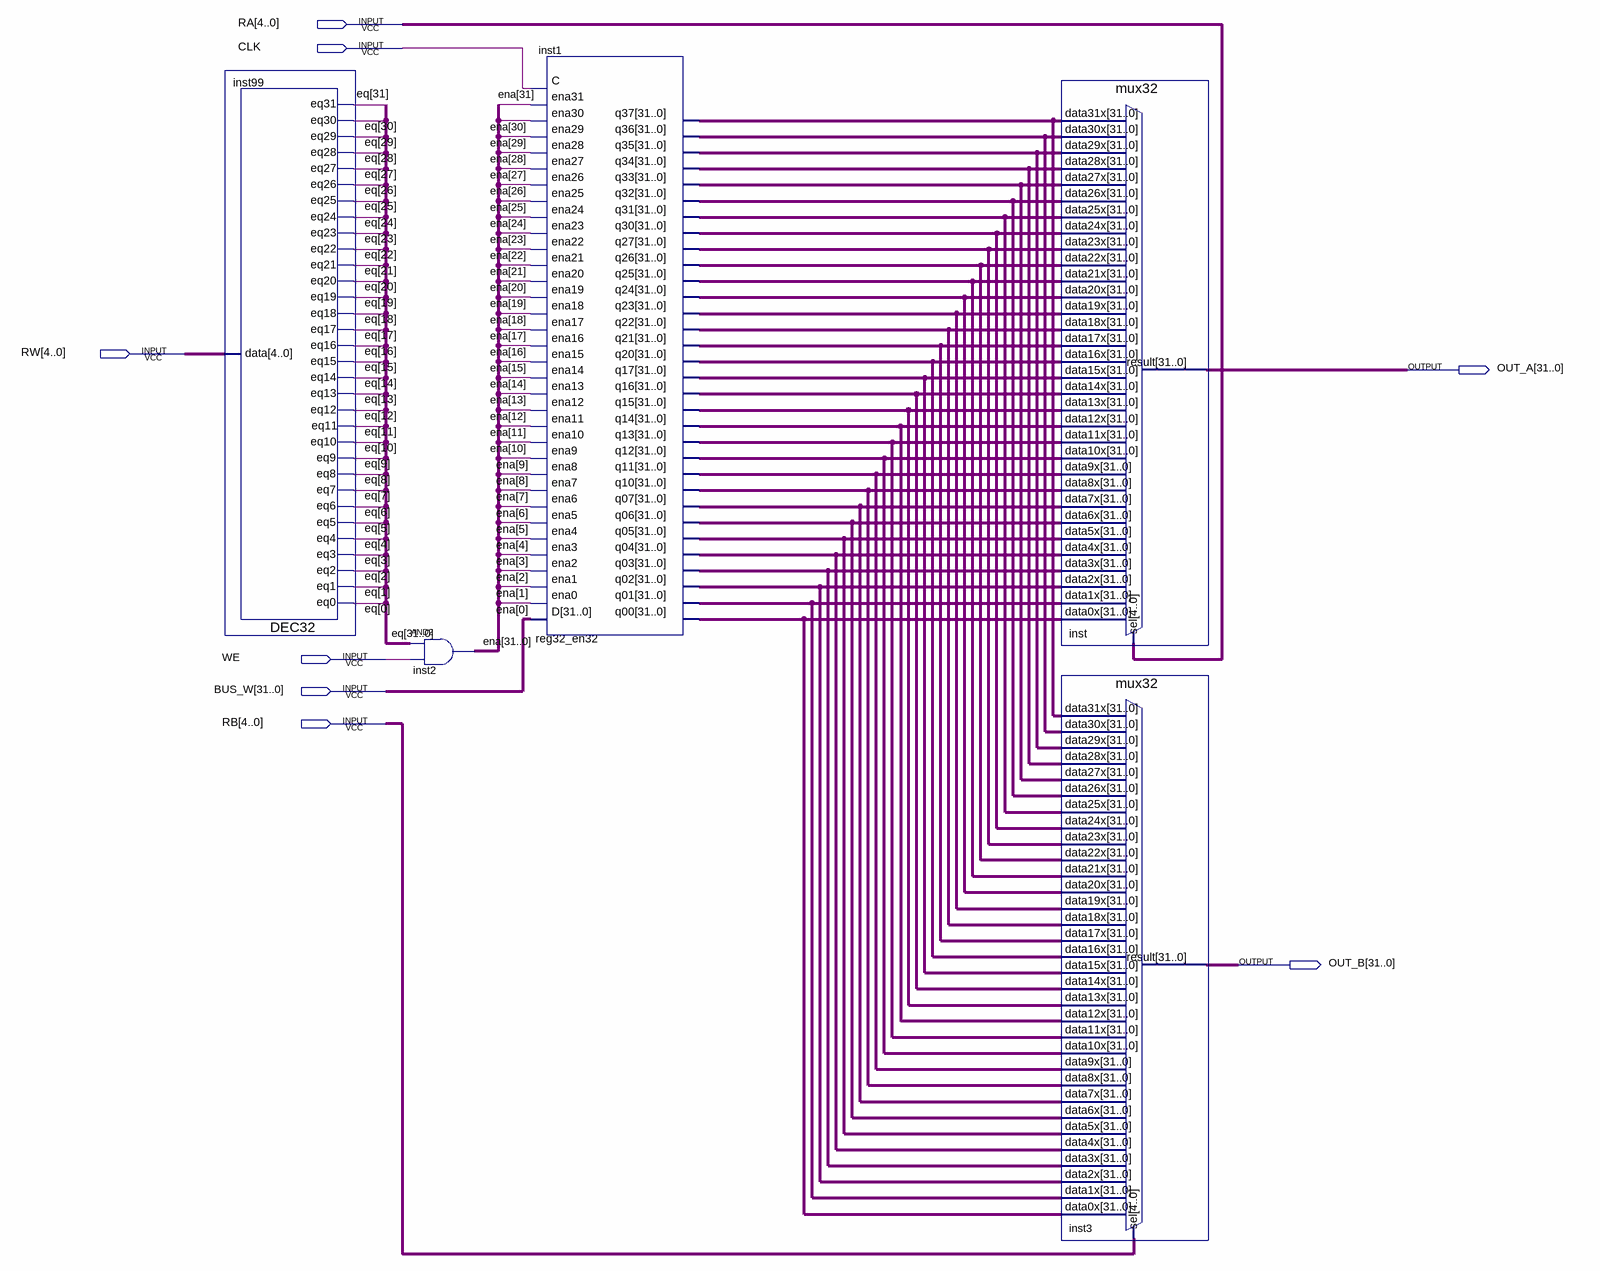
[diagram p0: schematic sheet]
// Quartus schematic Lab3_2.bdf as structural Verilog: 5 symbols, 8 pins
module Lab3_2 (
  input  [4:0] RA,
  input  CLK,
  input  [4:0] RW,
  input  WE,
  input  [31:0] BUS_W,
  input  [4:0] RB,
  output [31:0] OUT_A,
  output [31:0] OUT_B
);

  wire [31:0] ena, eq, inst1_q00, inst1_q01, inst1_q02, inst1_q03, inst1_q04, inst1_q05, inst1_q06,
       inst1_q07, inst1_q10, inst1_q11, inst1_q12, inst1_q13, inst1_q14, inst1_q15, inst1_q16, inst1_q17,
       inst1_q20, inst1_q21, inst1_q22, inst1_q23, inst1_q24, inst1_q25, inst1_q26, inst1_q27, inst1_q30,
       inst1_q31, inst1_q32, inst1_q33, inst1_q34, inst1_q35, inst1_q36, inst1_q37;

  DEC32 inst99 (
    .data(RW), .eq0(eq[0]), .eq1(eq[1]), .eq2(eq[2]), .eq3(eq[3]), .eq4(eq[4]), .eq5(eq[5]), .eq6(eq[6]),
    .eq7(eq[7]), .eq8(eq[8]), .eq9(eq[9]), .eq10(eq[10]), .eq11(eq[11]), .eq12(eq[12]), .eq13(eq[13]),
    .eq14(eq[14]), .eq15(eq[15]), .eq16(eq[16]), .eq17(eq[17]), .eq18(eq[18]), .eq19(eq[19]), .eq20(eq[20]),
    .eq21(eq[21]), .eq22(eq[22]), .eq23(eq[23]), .eq24(eq[24]), .eq25(eq[25]), .eq26(eq[26]), .eq27(eq[27]),
    .eq28(eq[28]), .eq29(eq[29]), .eq30(eq[30]), .eq31(eq[31]));
  assign ena = eq & {32{WE}};  // AND2 inst2, 32 bits wide
  reg32_en32 inst1 (
    .D(BUS_W), .ena0(ena[0]), .ena1(ena[1]), .ena2(ena[2]), .ena3(ena[3]), .ena4(ena[4]), .ena5(ena[5]),
    .ena6(ena[6]), .ena7(ena[7]), .ena8(ena[8]), .ena9(ena[9]), .ena10(ena[10]), .ena11(ena[11]),
    .ena12(ena[12]), .ena13(ena[13]), .ena14(ena[14]), .ena15(ena[15]), .ena16(ena[16]), .ena17(ena[17]),
    .ena18(ena[18]), .ena19(ena[19]), .ena20(ena[20]), .ena21(ena[21]), .ena22(ena[22]), .ena23(ena[23]),
    .ena24(ena[24]), .ena25(ena[25]), .ena26(ena[26]), .ena27(ena[27]), .ena28(ena[28]), .ena29(ena[29]),
    .ena30(ena[30]), .ena31(ena[31]), .C(CLK), .q00(inst1_q00), .q01(inst1_q01), .q02(inst1_q02),
    .q03(inst1_q03), .q04(inst1_q04), .q05(inst1_q05), .q06(inst1_q06), .q07(inst1_q07), .q10(inst1_q10),
    .q11(inst1_q11), .q12(inst1_q12), .q13(inst1_q13), .q14(inst1_q14), .q15(inst1_q15), .q16(inst1_q16),
    .q17(inst1_q17), .q20(inst1_q20), .q21(inst1_q21), .q22(inst1_q22), .q23(inst1_q23), .q24(inst1_q24),
    .q25(inst1_q25), .q26(inst1_q26), .q27(inst1_q27), .q30(inst1_q30), .q31(inst1_q31), .q32(inst1_q32),
    .q33(inst1_q33), .q34(inst1_q34), .q35(inst1_q35), .q36(inst1_q36), .q37(inst1_q37));
  mux32 inst (
    .data31x(inst1_q37), .data30x(inst1_q36), .data29x(inst1_q35), .data28x(inst1_q34), .data27x(inst1_q33),
    .data26x(inst1_q32), .data25x(inst1_q31), .data24x(inst1_q30), .data23x(inst1_q27), .data22x(inst1_q26),
    .data21x(inst1_q25), .data20x(inst1_q24), .data19x(inst1_q23), .data18x(inst1_q22), .data17x(inst1_q21),
    .data16x(inst1_q20), .data15x(inst1_q17), .data14x(inst1_q16), .data13x(inst1_q15), .data12x(inst1_q14),
    .data11x(inst1_q13), .data10x(inst1_q12), .data9x(inst1_q11), .data8x(inst1_q10), .data7x(inst1_q07),
    .data6x(inst1_q06), .data5x(inst1_q05), .data4x(inst1_q04), .data3x(inst1_q03), .data2x(inst1_q02),
    .data1x(inst1_q01), .data0x(inst1_q00), .sel(RA), .result(OUT_A));
  mux32 inst3 (
    .data31x(inst1_q37), .data30x(inst1_q36), .data29x(inst1_q35), .data28x(inst1_q34), .data27x(inst1_q33),
    .data26x(inst1_q32), .data25x(inst1_q31), .data24x(inst1_q30), .data23x(inst1_q27), .data22x(inst1_q26),
    .data21x(inst1_q25), .data20x(inst1_q24), .data19x(inst1_q23), .data18x(inst1_q22), .data17x(inst1_q21),
    .data16x(inst1_q20), .data15x(inst1_q17), .data14x(inst1_q16), .data13x(inst1_q15), .data12x(inst1_q14),
    .data11x(inst1_q13), .data10x(inst1_q12), .data9x(inst1_q11), .data8x(inst1_q10), .data7x(inst1_q07),
    .data6x(inst1_q06), .data5x(inst1_q05), .data4x(inst1_q04), .data3x(inst1_q03), .data2x(inst1_q02),
    .data1x(inst1_q01), .data0x(inst1_q00), .sel(RB), .result(OUT_B));
endmodule
